# EAGLE schematic ArduinoNano LearningBot 3-15-18 (EAGLE 8.4.1)
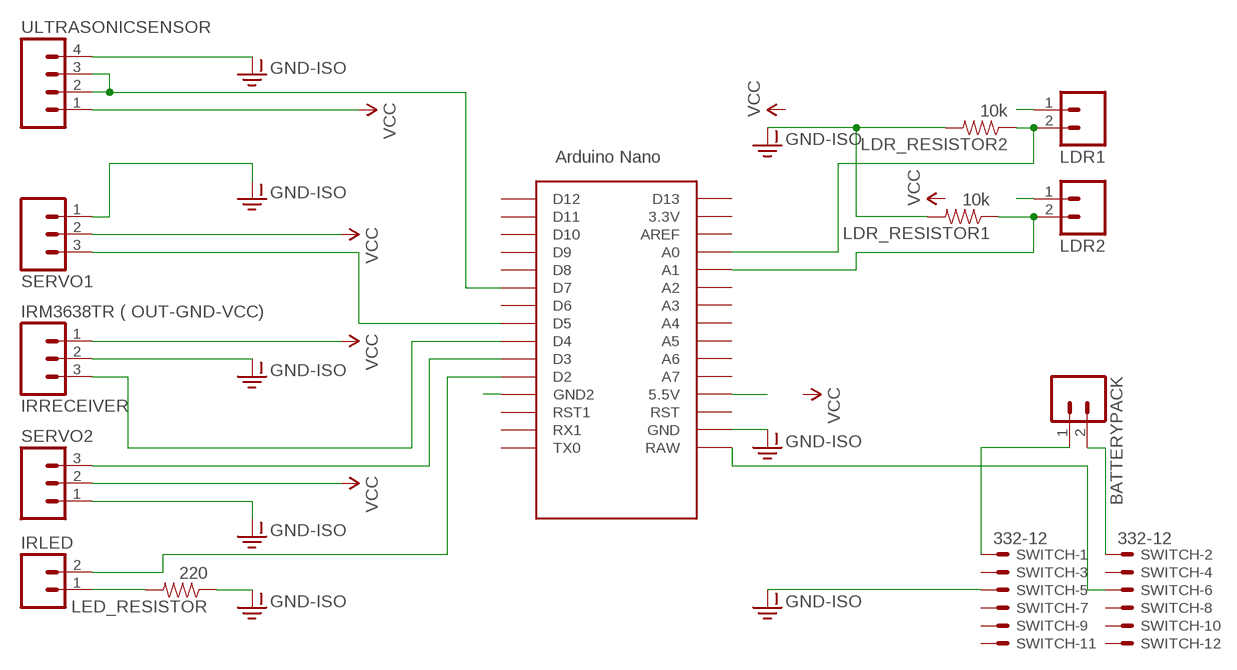
[diagram p0: schematic, sheet 1]

## Parts
BATTERYPACK  M02PTH  [1X02]
IRLED  M02LOCK  [1X02_LOCK]
IRRECEIVER  IRM3638TR ( OUT-GND-VCC)  M03LOCK  [1X03_LOCK]
LDR1  M02LOCK  [1X02_LOCK]
LDR2  M02LOCK  [1X02_LOCK]
LDR_RESISTOR1  10k  RESISTORPTH-1/4W  [AXIAL-0.4]
LDR_RESISTOR2  10k  RESISTORPTH-1/4W  [AXIAL-0.4]
LED_RESISTOR  220  RESISTORPTH-1/4W  [AXIAL-0.4]
SERVO1  M03LOCK  [1X03_LOCK]
SERVO2  M03LOCK  [1X03_LOCK]
SWITCH  332-12  [332-12]
U$1  NANO  [NANO]
ULTRASONICSENSOR  M04LOCK  [1X04_LOCK]

## Nets
A0: LDR2.2 LDR_RESISTOR1.P$1 U$1.A1
A1: LDR1.2 LDR_RESISTOR2.P$1 U$1.A0
ARDUINORAW: SWITCH.6 U$1.RAW
GND: BATTERYPACK.1 SWITCH.1
GND-ISO: IRRECEIVER.2 LDR_RESISTOR1.P$2 LDR_RESISTOR2.P$2 LED_RESISTOR.P$1 SERVO1.1 SERVO2.1 U$1.GND ULTRASONICSENSOR.4
GNDARDUINO: SWITCH.5 U$1.GND1(GND2) ; supply symbol labelled GND-ISO
IRGND: IRLED.1 LED_RESISTOR.P$2
IRLED: IRLED.2 U$1.D2
IRRECEIVER: IRRECEIVER.3 U$1.D4
RAW: BATTERYPACK.2 SWITCH.2
SERVO1: SERVO1.3 U$1.D5
SERVO2: SERVO2.3 U$1.D3
ULTRASONICSENSOR: U$1.D7 ULTRASONICSENSOR.2 ULTRASONICSENSOR.3
VCC: IRRECEIVER.1 LDR1.1 LDR2.1 SERVO1.2 SERVO2.2 U$1.5V(5.5V) ULTRASONICSENSOR.1
Unconnected: SWITCH.3 SWITCH.4 SWITCH.7 SWITCH.8 SWITCH.9 SWITCH.10 SWITCH.11 SWITCH.12 U$1.3.3V U$1.A2 U$1.A3 U$1.A4 U$1.A5 U$1.A6 U$1.A7 U$1.AREF U$1.D6 U$1.D8 U$1.D9 U$1.D10 U$1.D11 U$1.D12 U$1.D13 U$1.ICSP1 U$1.ICSP2 U$1.ICSP3 U$1.ICSP4 U$1.ICSP5 U$1.ICSP6 U$1.RST U$1.RST1 U$1.RX1 U$1.TX0

## Library data of the parts
BATTERYPACK IRLED LDR1 LDR2 = SparkFun-Connectors:M02: Standard 2-pin 0.1" header. Use with - straight break away headers ( PRT-00116) - right angle break away headers (PRT-00553) - swiss pins (PRT-00743) - machine pins (PRT-00117) - female headers (PRT-00115) Molex polarized connector foot print use with: PRT-08233 with associated crimp pins and housings. 2.54_SCREWTERM for use with PRT-10571. 3.5mm Screw Terminal footprints for PRT-08084 5mm Screw Terminal footprints for use with PRT-08432
IRRECEIVER SERVO1 SERVO2 = SparkFun-Connectors:M03: Header 3 Standard 3-pin 0.1" header. Use with straight break away headers (SKU : PRT-00116), right angle break away headers (PRT-00553), swiss pins (PRT-00743), machine pins (PRT-00117), and female headers (PRT-00115). Molex polarized connector foot print use with SKU : PRT-08232 with associated crimp pins and housings.
LDR_RESISTOR1 LDR_RESISTOR2 LED_RESISTOR = SparkFun-Passives:RESISTOR: Resistor Basic schematic elements and footprints for 0603, 1206, and PTH resistors.
SWITCH = con-garry:332-12: 12 Pin - 2mm Dual Row Source: www.mpe-connector.de / garry_shortform_2012.pdf
U$1 = Arduino-clone:NANO: Arduino Nano
ULTRASONICSENSOR = SparkFun-Connectors:M04: Header 4 Standard 4-pin 0.1" header. Use with straight break away headers (SKU : PRT-00116), right angle break away headers (PRT-00553), swiss pins (PRT-00743), machine pins (PRT-00117), and female headers (PRT-00115). Molex polarized connector foot print use with SKU : PRT-08231 with associated crimp pins and housings. 1MM SMD Version SKU: PRT-10208; PROD_ID: CONN-09696